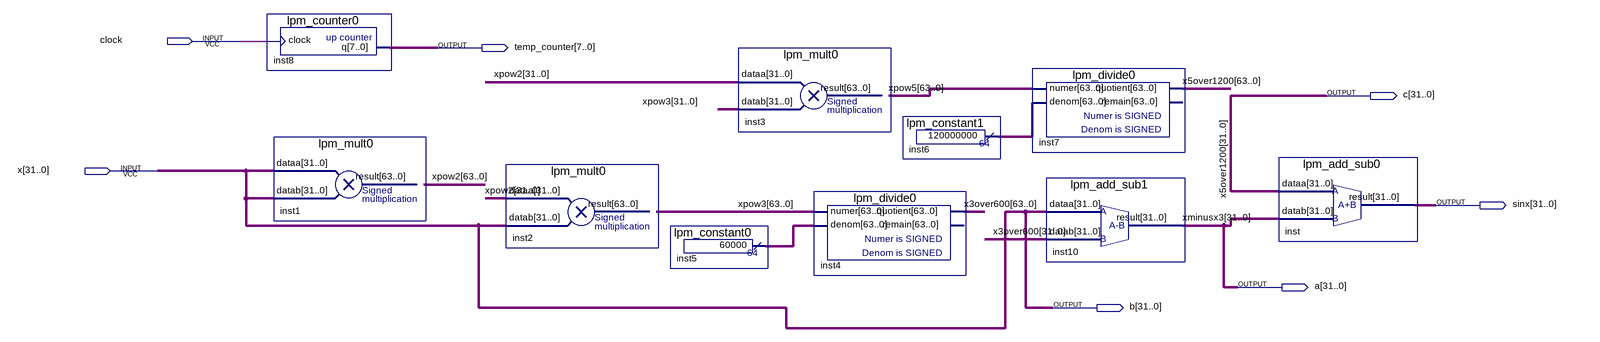
[diagram p0: schematic sheet]
// Quartus schematic calcula_seno.bdf as structural Verilog: 10 symbols, 7 pins
module calcula_seno (
  input  clock,
  input  [31:0] x,
  output [7:0] temp_counter,
  output [31:0] c,
  output [31:0] sinx,
  output [31:0] a,
  output [31:0] b
);

  wire [63:0] inst5_result, inst6_result, x3over600, xpow2, xpow3, xpow5;
  wire [63:32] x5over1200;

  lpm_counter0 inst8 (.clock(clock), .q(temp_counter));
  lpm_mult0 inst1 (.dataa(x), .datab(x), .result(xpow2));
  lpm_mult0 inst2 (.dataa(xpow2[31:0]), .datab(x), .result(xpow3));
  lpm_constant0 inst5 (.result(inst5_result));
  lpm_mult0 inst3 (.dataa(xpow2[31:0]), .datab(xpow3[31:0]), .result(xpow5));
  lpm_divide0 inst4 (.numer(xpow3), .denom(inst5_result), .quotient(x3over600));  // open: remain
  lpm_constant1 inst6 (.result(inst6_result));
  lpm_divide0 inst7 (.numer(xpow5), .denom(inst6_result), .quotient({x5over1200, c}));  // open: remain
  lpm_add_sub1 inst10 (.dataa(x), .datab(x3over600[31:0]), .result(a));
  lpm_add_sub0 inst (.dataa(c), .datab(a), .result(sinx));

  assign b = x;

  // Other names for the same wires on the sheet: x5over1200[31:0] = c; xminusx3[31:0] = a
endmodule
